# Altium schematic sheet RS232_IrDA.SCHDOC
size A4; Revision: B.2
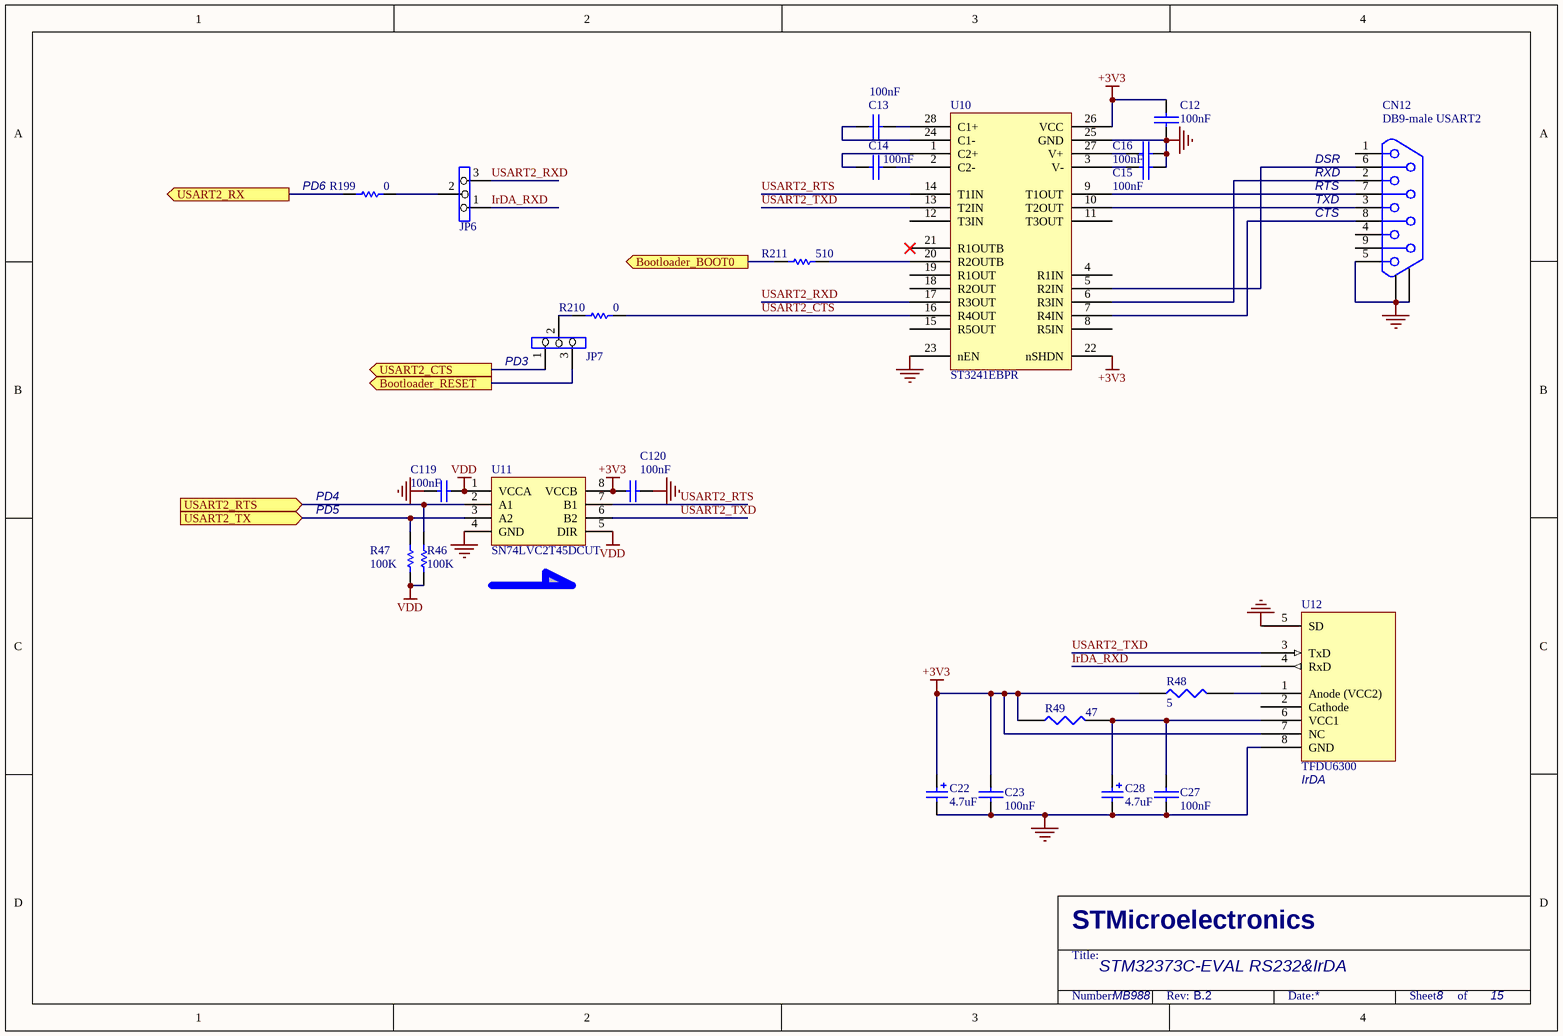
[diagram p0: RS232_IrDA.SCHDOC]

## Parts
C12  100nF  [0603C]
C13  100nF  [0603C]
C14  100nF  [0603C]
C15  100nF  [0603C]
C16  100nF  [0603C]
C22  4.7uF  [TAN-A]
C23  100nF  [0603C]
C27  100nF  [0603C]
C28  4.7uF  [TAN-A]
C119  100nF  [0603C]
C120  100nF  [0603C]
CN12  DB9-male USART2  [DB9/M]
JP6  (no value)  [SIP3]
JP7  (no value)  [SIP3]
R46  100K  [0603R]
R47  100K  [0603R]
R48  5  [0603R]
R49  47  [0603R]
R199  0  [0603R]
R210  0  [0603R]
R211  510  [0603R]
U10  ST3241EBPR  [SSOP28]
U11  SN74LVC2T45DCUT  [VSSOP8]
U12  TFDU6300  [IR_VISHAY3]

## Ports
Bootloader_BOOT0 (out), Bootloader_RESET (out), USART2_CTS (out), USART2_RTS (in), USART2_RX (out), USART2_TX (in)

## Nets
+3V3: C12.2 C22.1 C23.1 C120.2 R48.1 R49.1 U10.22(nSHDN) U10.26(VCC) U11.8(VCCB) U12.7(NC)
GND: C12.1 C15.2 C16.2 C22.2 C23.2 C27.2 C28.2 C119.1 C120.1 CN12.0 CN12.5 U10.23(nEN) U10.25(GND) U11.4(GND) U12.5(SD) U12.8(GND)
VDD: C119.2 R46.2 R47.2 U11.1(VCCA) U11.5(DIR)
Bootloader_BOOT0: R211.1 ; port Bootloader_BOOT0
Bootloader_RESET: JP7.3 ; port Bootloader_RESET
IrDA_RXD: JP6.1 U12.4(RxD)
USART2_CTS: JP7.1 ; port USART2_CTS
USART2_CTS: R210.2 U10.16(R4OUT)  [a separate net that carries the same name]
USART2_RTS: U10.14(T1IN) U11.7(B1)
USART2_RTS: R46.1 U11.2(A1) ; port USART2_RTS  [a separate net that carries the same name]
USART2_RX: R199.1 ; port USART2_RX
USART2_RXD: JP6.3 U10.17(R3OUT)
USART2_TX: R47.1 U11.3(A2) ; port USART2_TX
USART2_TXD: U10.13(T2IN) U11.6(B2) U12.3(TxD)
NetC13_1: C13.1 U10.24(C1-)
NetC13_2: C13.2 U10.28(C1+)
NetC14_1: C14.1 U10.1(C2+)
NetC14_2: C14.2 U10.2(C2-)
NetC15_1: C15.1 U10.3(V-)
NetC16_1: C16.1 U10.27(V+)
NetC27_1: C27.1 C28.1 R49.2 U12.6(VCC1)
NetCN12_2: CN12.2 U10.6(R3IN)
NetCN12_3: CN12.3 U10.10(T2OUT)
NetCN12_6: CN12.6 U10.5(R2IN)
NetCN12_7: CN12.7 U10.9(T1OUT)
NetCN12_8: CN12.8 U10.7(R4IN)
NetJP6_2: JP6.2 R199.2
NetJP7_2: JP7.2 R210.1
NetR48_2: R48.2 U12.1(Anode_(VCC2))
NetR211_2: R211.2 U10.20(R2OUTB)

Not connected (* = marked no-connect by the designer): CN12 1 4 9; U10 4(R1IN) 8(R5IN) 11(T3OUT) 12(T3IN) 15(R5OUT) 18(R2OUT) 19(R1OUT) 21(R1OUTB)*; U12 2(Cathode)

## Notes on the sheet
- (near CN12) RXD
- (near CN12) DSR
- (near R199) PD6
- (near CN12) RTS
- (near CN12) TXD
- (near CN12) CTS
- (near JP7) PD3
- PD5
- PD4
- (near U12) IrDA
- STM32373C-EVAL RS232&IrDA
- MB988
- 8
- 15
- STMicroelectronics
- Title:
- Number:
- Rev:
- Date:
- Sheet       of

## Library data of the parts
C12-C16 C23 C27 = CAP: Capacitor
C22 C28 = Cap Pol1: Polarized Capacitor (Radial); Value: 100pF; Published: 8-Jun-2000; Revision: July-2002: Re-released for DXP Platform.; Publisher: Altium Limited
C119 C120 = CAP: Capacitor; Value: 100pF; Published: 8-Jun-2000; Revision: July-2002: Re-released for DXP Platform.; Publisher: Altium Limited
CN12 = DB9
JP6 JP7 = Jumper3
R46 R47 R199 R210 R211 = Res1: Resistor; Value: 1K; Published: 8-Jun-2000; Revision: July-2002: Re-released for DXP Platform.; Publisher: Altium Limited
R48 R49 = RES1
U10 = ST3241
U12 = TFDU4300